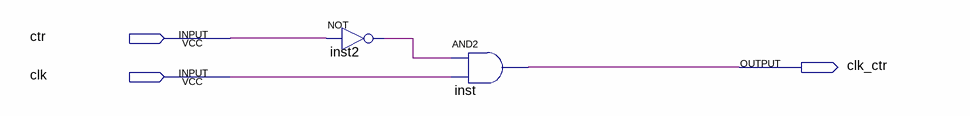
[diagram p0: schematic sheet]
// Quartus schematic clk_ctr.bdf as structural Verilog: 2 symbols, 3 pins
module clk_ctr (
  input  ctr,
  input  clk,
  output clk_ctr
);

  wire inst2_out;

  not inst2 (inst2_out, ctr);
  and inst (clk_ctr, inst2_out, clk);
endmodule
